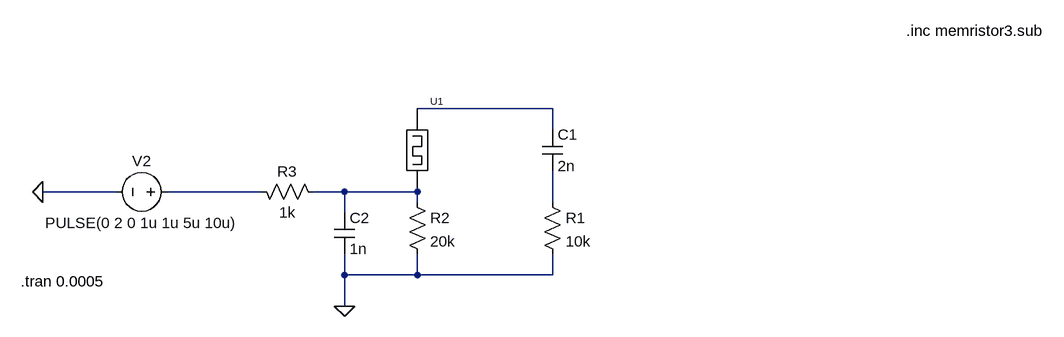
[diagram p0: schematic Draft1.asc]
Draft1.asc, the LTspice schematic file:
Version 4
SHEET 1 1224 680
WIRE 448 144 240 144
WIRE 448 176 448 144
WIRE -224 272 -336 272
WIRE 0 272 -144 272
WIRE 128 272 80 272
WIRE 240 272 128 272
WIRE 240 288 240 272
WIRE 448 288 448 240
WIRE 128 304 128 272
WIRE 128 400 128 368
WIRE 240 400 240 368
WIRE 240 400 128 400
WIRE 448 400 448 368
WIRE 448 400 240 400
WIRE 128 448 128 400
FLAG -336 272 0
FLAG 128 448 0
SYMBOL res 432 272 R0
SYMATTR InstName R1
SYMATTR Value 10k
SYMBOL cap 432 176 R0
SYMATTR InstName C1
SYMATTR Value 2n
SYMBOL voltage -128 272 R90
WINDOW 0 -32 56 VBottom 2
WINDOW 3 32 56 VTop 2
WINDOW 123 0 0 Left 0
WINDOW 39 0 0 Left 0
SYMATTR InstName V2
SYMATTR Value PULSE(0 2 0 1u 1u 5u 10u)
SYMBOL ts 240 208 R0
SYMATTR Value memristor3
SYMATTR InstName U1
SYMBOL res 224 272 R0
SYMATTR InstName R2
SYMATTR Value 20k
SYMBOL cap 112 304 R0
SYMATTR InstName C2
SYMATTR Value 1n
SYMBOL res -16 256 M90
WINDOW 0 0 56 VBottom 2
WINDOW 3 32 56 VTop 2
SYMATTR InstName R3
SYMATTR Value 1k
TEXT 992 24 Left 2 !.inc memristor3.sub
TEXT -370 410 Left 2 !.tran 0.0005

The netlist it stands for:
* Draft1.asc
R1 N004 0 10k
C1 N001 N004 2n
V2 N002 0 PULSE(0 2 0 1u 1u 5u 10u)
XU1 N001 N003 memristor3  ; pins top bot
R2 N003 0 20k
C2 N003 0 1n
R3 N002 N003 1k
.inc memristor3.sub
.tran 0.0005
.backanno
.end